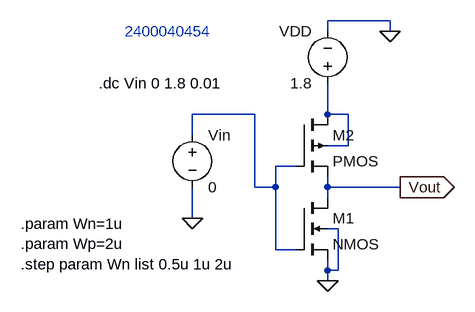
[diagram p0: schematic Noise margin.asc]
Noise margin.asc, the LTspice schematic file:
Version 4.1
SHEET 1 880 680
WIRE 304 -80 208 -80
WIRE 208 -64 208 -80
WIRE 304 -64 304 -80
WIRE 96 64 0 64
WIRE 208 64 208 16
WIRE 240 64 208 64
WIRE 0 96 0 64
WIRE 240 112 240 64
WIRE 240 112 208 112
WIRE 160 144 128 144
WIRE 96 176 96 64
WIRE 128 176 128 144
WIRE 128 176 96 176
WIRE 208 176 208 160
WIRE 320 176 208 176
WIRE 208 192 208 176
WIRE 0 224 0 176
WIRE 224 240 208 240
WIRE 128 272 128 176
WIRE 160 272 128 272
WIRE 208 304 208 288
WIRE 224 304 224 240
WIRE 224 304 208 304
WIRE 208 320 208 304
FLAG 208 320 0
FLAG 0 224 0
FLAG 304 -64 0
FLAG 320 176 Vout
IOPIN 320 176 Out
SYMBOL nmos4 160 192 R0
SYMATTR InstName M1
SYMATTR Value2 l=180n w=Wn
SYMBOL pmos4 160 64 R0
SYMATTR InstName M2
SYMATTR Value2 l=180n w=Wp
SYMBOL voltage 208 32 R180
WINDOW 0 24 96 Left 2
WINDOW 3 24 16 Left 2
WINDOW 123 0 0 Left 0
WINDOW 39 0 0 Left 0
SYMATTR InstName VDD
SYMATTR Value 1.8
SYMBOL voltage 0 80 R0
WINDOW 123 0 0 Left 0
WINDOW 39 0 0 Left 0
SYMATTR InstName Vin
SYMATTR Value 0
TEXT -144 16 Left 2 !.dc Vin 0 1.8 0.01
TEXT -104 -64 Left 2 ;2400040454
TEXT -264 232 Left 2 !.param Wn=1u\n.param Wp=2u\n.step param Wn list 0.5u 1u 2u

The netlist it stands for:
* Noise margin.asc
M1 Vout N001 0 0 NMOS l=180n w=Wn
M2 N002 N001 Vout N002 PMOS l=180n w=Wp
VDD N002 0 1.8
Vin N001 0 0
.model NMOS NMOS
.model PMOS PMOS
.lib standard.mos
.dc Vin 0 1.8 0.01
* 2400040454
.param Wn=1u
.param Wp=2u
.step param Wn list 0.5u 1u 2u
.backanno
.end